# Altium schematic sheet main_board.SchDoc
size A3
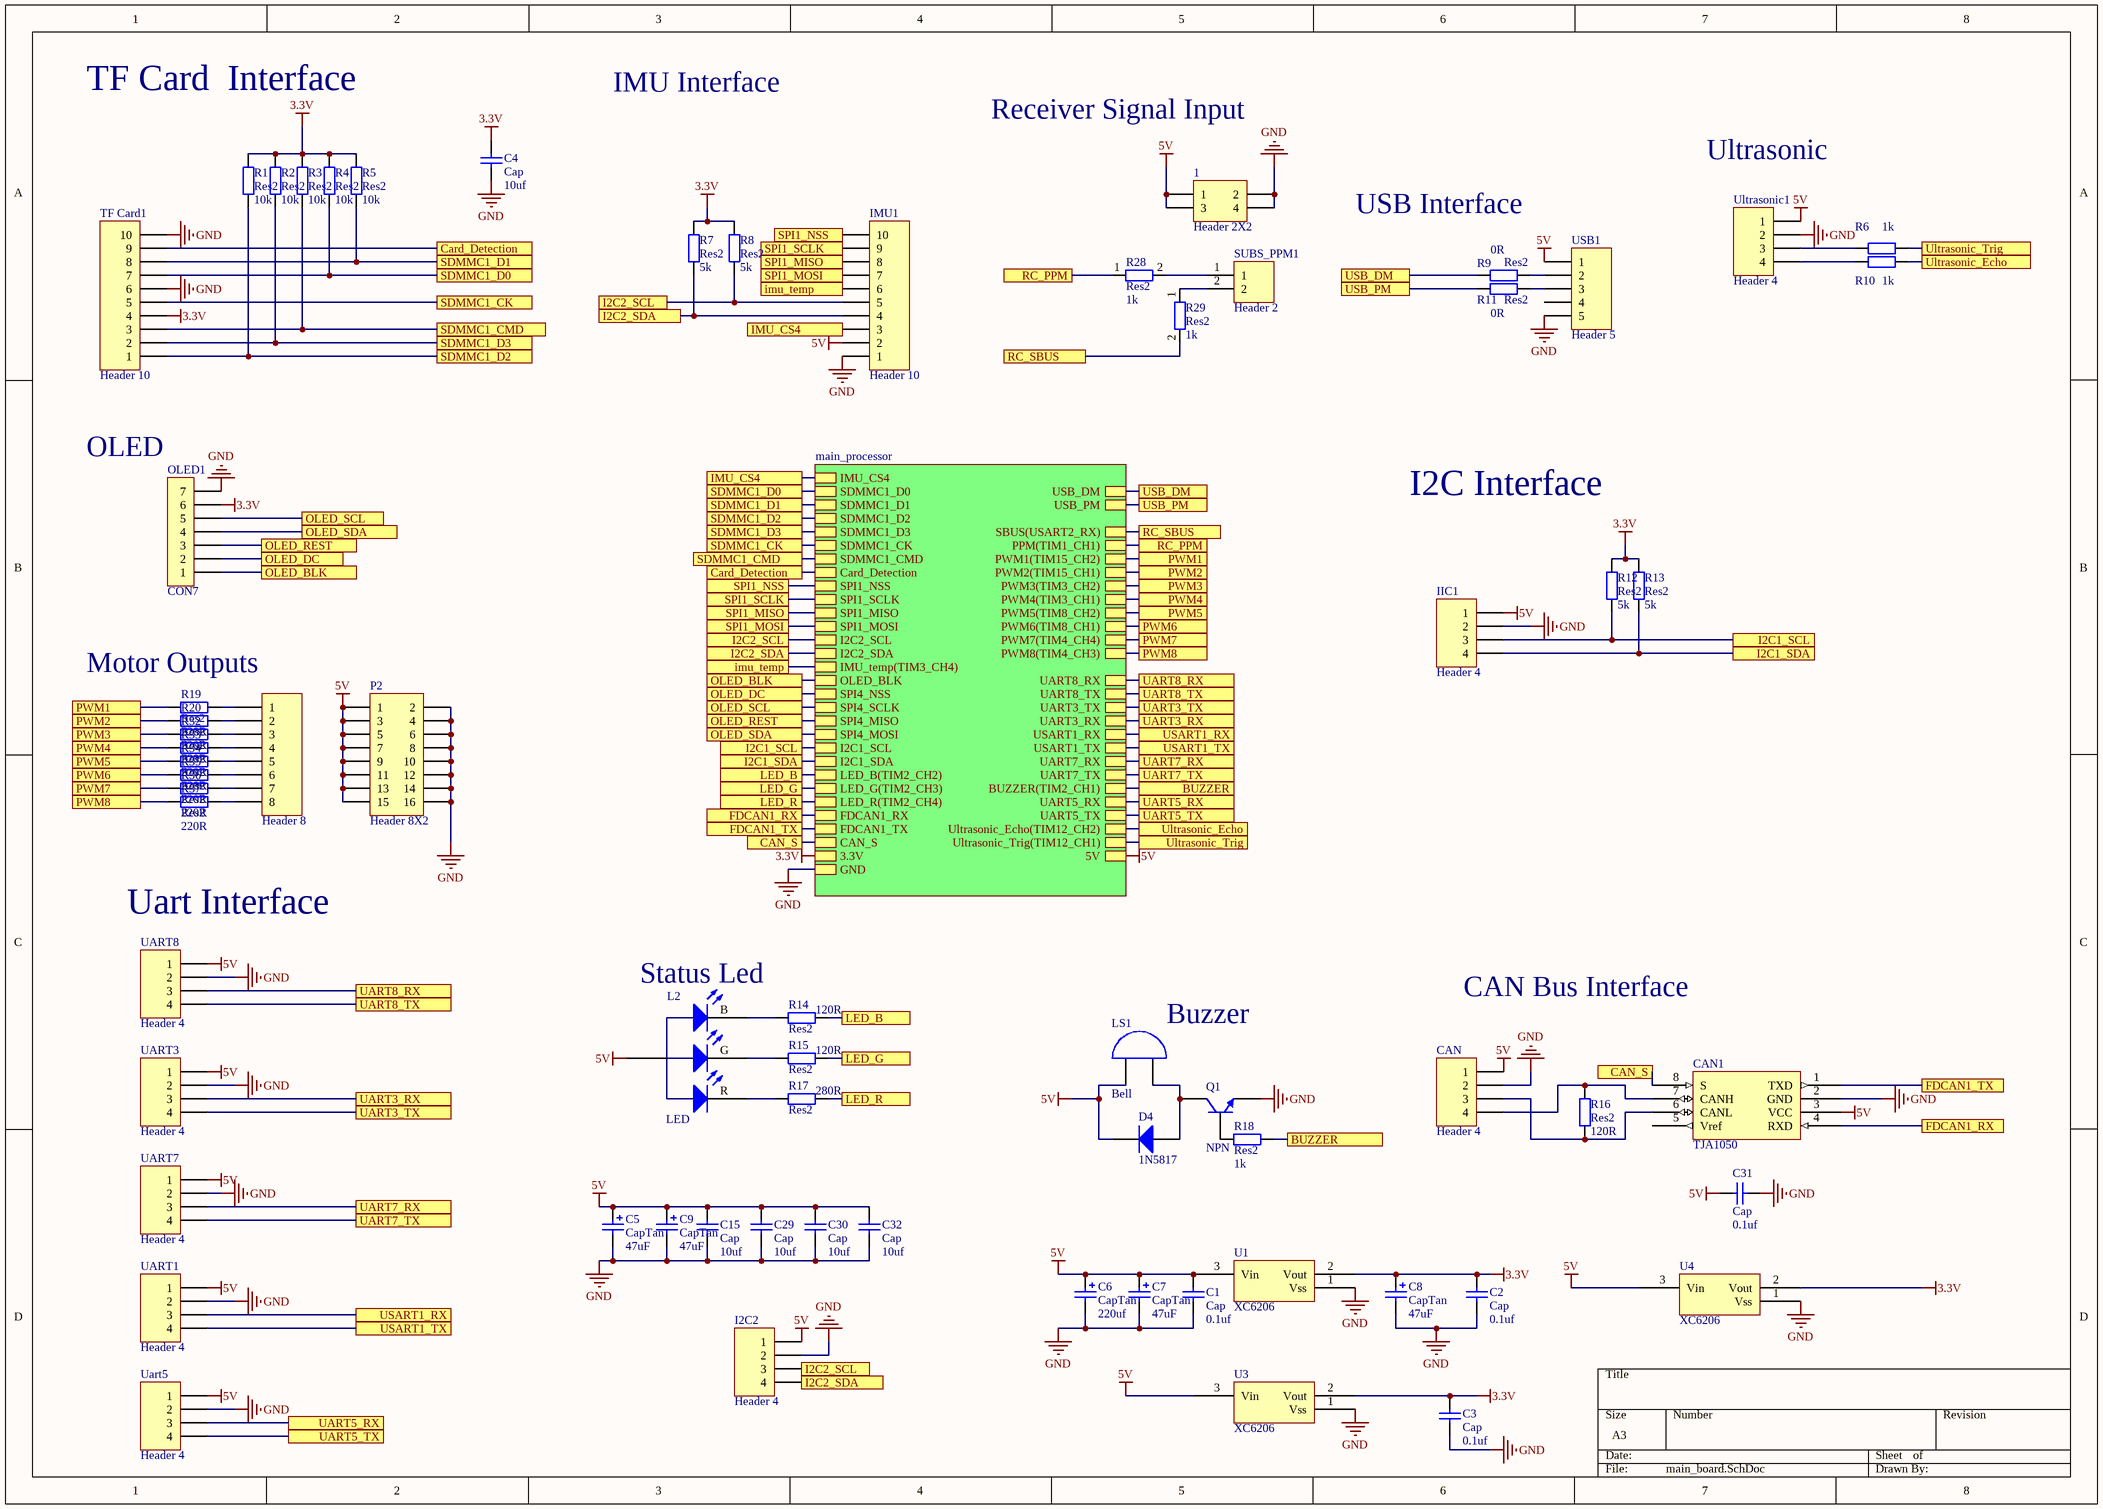
[diagram p0: main_board.SchDoc]

## Parts
1  Header 2X2  [HDR2X2]
?  Header 8  [HDR1X8]
C1  Cap  value 0.1uf  [0603]
C2  Cap  value 0.1uf  [0603]
C3  Cap  value 0.1uf  [0603]
C4  Cap  value 10uf  [0603]
C5  CapTan  value 47uF  [1206_P]
C6  CapTan  value 220uf  [3528_P]
C7  CapTan  value 47uF  [1206_P]
C8  CapTan  value 47uF  [1206_P]
C9  CapTan  value 47uF  [1206_P]
C15  Cap  value 10uf  [0603]
C29  Cap  value 10uf  [0603]
C30  Cap  value 10uf  [0603]
C31  Cap  value 0.1uf  [0603]
C32  Cap  value 10uf  [0603]
CAN  Header 4  [SH_1.25mm_LT_4P]
CAN1  TJA1050  [SO8_M]
D4  1N5817  [SOD323]
I2C2  Header 4  [SH_1.25mm_LT_4P]
IIC1  Header 4  [SH_1.25mm_LT_4P]
IMU1  Header 10  [FPC 0.5mm 10pin]
L2  LED  [LED_3528_RGB]
LS1  Bell  [Buzzer_1030]
OLED1  CON7  [HDR1X7]
P2  Header 8X2  [HDR2X8]
Q1  NPN  [SOT23_N]
R1  Res2  value 10k  [0603]
R2  Res2  value 10k  [0603]
R3  Res2  value 10k  [0603]
R4  Res2  value 10k  [0603]
R5  Res2  value 10k  [0603]
R6  value 1k  [0603]  (hidden comment: Res2)
R7  Res2  value 5k  [0603]
R8  Res2  value 5k  [0603]
R9  Res2  value 0R  [0603]
R10  value 1k  [0603]  (hidden comment: Res2)
R11  Res2  value 0R  [0603]
R12  Res2  value 5k  [0603]
R13  Res2  value 5k  [0603]
R14  Res2  value 120R  [0603]
R15  Res2  value 120R  [0603]
R16  Res2  value 120R  [0603]
R17  Res2  value 280R  [0603]
R18  Res2  value 1k  [0603]
R19  Res2  value 220R  [0603]
R20  Res2  value 220R  [0603]
R28  Res2  value 1k  [0603]
R29  Res2  value 1k  [0603]
R32  Res2  value 220R  [0603]
R33  Res2  value 220R  [0603]
R34  Res2  value 220R  [0603]
R35  Res2  value 220R  [0603]
R36  Res2  value 220R  [0603]
R37  Res2  value 220R  [0603]
SUBS_PPM1  Header 2  [HDR1X2]
TF_Card1  Header 10  [MicroSD]
U1  XC6206  [SOT23]
U3  XC6206  [SOT23]
U4  XC6206  [SOT23]
UART1  Header 4  [SH_1.25mm_LT_4P]
UART3  Header 4  [SH_1.25mm_LT_4P]
Uart5  Header 4  [SH_1.25mm_LT_4P]
UART7  Header 4  [SH_1.25mm_LT_4P]
UART8  Header 4  [SH_1.25mm_LT_4P]
Ultrasonic1  Header 4  [SH_1.25mm_LT_4P]
USB1  Header 5  [micro usb Type B SMC]

## Sub-sheets
main_processor = main_processor: SDMMC1_D0, SDMMC1_D1, SDMMC1_D2, SDMMC1_D3, SDMMC1_CK, SDMMC1_CMD, Card_Detection, SPI1_SCLK, SPI1_MISO, SPI1_MOSI, I2C2_SCL, I2C2_SDA, IMU_temp(TIM3_CH4), SPI1_NSS, SPI4_NSS, SPI4_SCLK, SPI4_MISO, SPI4_MOSI, USB_DM, USB_PM, PWM1(TIM15_CH2), PWM2(TIM15_CH1), PWM3(TIM3_CH2), PWM4(TIM3_CH1), PWM5(TIM8_CH2), PWM6(TIM8_CH1), PWM7(TIM4_CH4), PWM8(TIM4_CH3), UART8_RX, UART8_TX, UART3_TX, UART3_RX, USART1_RX, USART1_TX, UART7_RX, UART7_TX, I2C1_SCL, I2C1_SDA, LED_B(TIM2_CH2), LED_G(TIM2_CH3), LED_R(TIM2_CH4), BUZZER(TIM2_CH1), UART5_RX, UART5_TX, FDCAN1_RX, FDCAN1_TX, Ultrasonic_Echo(TIM12_CH2), Ultrasonic_Trig(TIM12_CH1), 3.3V, GND, 5V, SBUS(USART2_RX), PPM(TIM1_CH1), CAN_S, OLED_BLK, IMU_CS4

## Ports
BUZZER, CAN_S, Card_Detection, FDCAN1_RX, FDCAN1_TX, I2C1_SCL, I2C1_SDA, I2C2_SCL, I2C2_SDA, IMU_CS4, imu_temp, LED_B, LED_G, LED_R, OLED_BLK, OLED_DC, OLED_REST, OLED_SCL, OLED_SDA, PWM1, PWM2, PWM3, PWM4, PWM5, PWM6, PWM7, PWM8, RC_PPM, RC_SBUS, SDMMC1_CK, SDMMC1_CMD, SDMMC1_D0, SDMMC1_D1, SDMMC1_D2, SDMMC1_D3, SPI1_MISO, SPI1_MOSI, SPI1_NSS, SPI1_SCLK, UART3_RX, UART3_TX, UART5_RX, UART5_TX, UART7_RX, UART7_TX, UART8_RX, UART8_TX, Ultrasonic_Echo, Ultrasonic_Trig, USART1_RX, USART1_TX, USB_DM, USB_PM

## Nets
3.3V: C2.2 C3.2 C4.2 C8.1 OLED1.6 R1.2 R2.2 R3.1 R4.2 R5.2 R7.2 R8.2 R12.2 R13.2 TF_Card1.4 U1.2(Vout) U3.2(Vout) U4.2(Vout) ; sheet main_processor/3.3V
5V: 1.1 1.3 C1.2 C5.1 C6.1 C7.1 C9.1 C15.2 C29.2 C30.2 C31.2 C32.2 CAN.1 CAN1.3(VCC) D4.2(K) I2C2.1 IIC1.1 IMU1.2 L2.1 LS1.1(A) P2.1 P2.3 P2.5 P2.7 P2.9 P2.11 P2.13 P2.15 U1.3(Vin) U3.3(Vin) U4.3(Vin) UART1.1 UART3.1 Uart5.1 UART7.1 UART8.1 Ultrasonic1.1 USB1.1 ; sheet main_processor/5V
GND: 1.2 1.4 C1.1 C2.1 C3.1 C4.1 C5.2 C6.2 C7.2 C8.2 C9.2 C15.1 C29.1 C30.1 C31.1 C32.1 CAN.2 CAN1.2(GND) I2C2.2 IIC1.2 IMU1.1 OLED1.7 P2.2 P2.4 P2.6 P2.8 P2.10 P2.12 P2.14 P2.16 Q1.3(E) TF_Card1.6 TF_Card1.10 U1.1(Vss) U3.1(Vss) U4.1(Vss) UART1.2 UART3.2 Uart5.2 UART7.2 UART8.2 Ultrasonic1.2 USB1.5 ; sheet main_processor/GND
BUZZER: R18.1 ; port BUZZER, sheet main_processor/BUZZER(TIM2_CH1)
CAN_S: CAN1.8(S) ; port CAN_S, sheet main_processor/CAN_S
Card_Detection: TF_Card1.9 ; port Card_Detection, sheet main_processor/Card_Detection
FDCAN1_RX: CAN1.4(RXD) ; port FDCAN1_RX, sheet main_processor/FDCAN1_RX
FDCAN1_TX: CAN1.1(TXD) ; port FDCAN1_TX, sheet main_processor/FDCAN1_TX
I2C1_SCL: IIC1.3 R12.1 ; port I2C1_SCL, sheet main_processor/I2C1_SCL
I2C1_SDA: IIC1.4 R13.1 ; port I2C1_SDA, sheet main_processor/I2C1_SDA
I2C2_SCL: I2C2.3 IMU1.5 R8.1 ; port I2C2_SCL, sheet main_processor/I2C2_SCL
I2C2_SDA: I2C2.4 IMU1.4 R7.1 ; port I2C2_SDA, sheet main_processor/I2C2_SDA
IMU_CS4: IMU1.3 ; port IMU_CS4, sheet main_processor/IMU_CS4
imu_temp: IMU1.6 ; port imu_temp, sheet main_processor/IMU_temp(TIM3_CH4)
LED_B: R14.1 ; port LED_B, sheet main_processor/LED_B(TIM2_CH2)
LED_G: R15.1 ; port LED_G, sheet main_processor/LED_G(TIM2_CH3)
LED_R: R17.1 ; port LED_R, sheet main_processor/LED_R(TIM2_CH4)
OLED_BLK: OLED1.1 ; port OLED_BLK, sheet main_processor/OLED_BLK
OLED_DC: OLED1.2 ; port OLED_DC, sheet main_processor/SPI4_NSS
OLED_REST: OLED1.3 ; port OLED_REST, sheet main_processor/SPI4_MISO
OLED_SCL: OLED1.5 ; port OLED_SCL, sheet main_processor/SPI4_SCLK
OLED_SDA: OLED1.4 ; port OLED_SDA, sheet main_processor/SPI4_MOSI
PWM1: R19.2 ; port PWM1, sheet main_processor/PWM1(TIM15_CH2)
PWM2: R20.2 ; port PWM2, sheet main_processor/PWM2(TIM15_CH1)
PWM3: R32.2 ; port PWM3, sheet main_processor/PWM3(TIM3_CH2)
PWM4: R33.2 ; port PWM4, sheet main_processor/PWM4(TIM3_CH1)
PWM5: R34.2 ; port PWM5, sheet main_processor/PWM5(TIM8_CH2)
PWM6: R35.2 ; port PWM6, sheet main_processor/PWM6(TIM8_CH1)
PWM7: R36.2 ; port PWM7, sheet main_processor/PWM7(TIM4_CH4)
PWM8: R37.2 ; port PWM8, sheet main_processor/PWM8(TIM4_CH3)
RC_PPM: R28.1 ; port RC_PPM, sheet main_processor/PPM(TIM1_CH1)
RC_SBUS: R29.2 ; port RC_SBUS, sheet main_processor/SBUS(USART2_RX)
SDMMC1_CK: TF_Card1.5 ; port SDMMC1_CK, sheet main_processor/SDMMC1_CK
SDMMC1_CMD: R3.2 TF_Card1.3 ; port SDMMC1_CMD, sheet main_processor/SDMMC1_CMD
SDMMC1_D0: R4.1 TF_Card1.7 ; port SDMMC1_D0, sheet main_processor/SDMMC1_D0
SDMMC1_D1: R5.1 TF_Card1.8 ; port SDMMC1_D1, sheet main_processor/SDMMC1_D1
SDMMC1_D2: R1.1 TF_Card1.1 ; port SDMMC1_D2, sheet main_processor/SDMMC1_D2
SDMMC1_D3: R2.1 TF_Card1.2 ; port SDMMC1_D3, sheet main_processor/SDMMC1_D3
SPI1_MISO: IMU1.8 ; port SPI1_MISO, sheet main_processor/SPI1_MISO
SPI1_MOSI: IMU1.7 ; port SPI1_MOSI, sheet main_processor/SPI1_MOSI
SPI1_NSS: IMU1.10 ; port SPI1_NSS, sheet main_processor/SPI1_NSS
SPI1_SCLK: IMU1.9 ; port SPI1_SCLK, sheet main_processor/SPI1_SCLK
UART3_RX: UART3.3 ; port UART3_RX, sheet main_processor/UART3_RX
UART3_TX: UART3.4 ; port UART3_TX, sheet main_processor/UART3_TX
UART5_RX: Uart5.3 ; port UART5_RX, sheet main_processor/UART5_RX
UART5_TX: Uart5.4 ; port UART5_TX, sheet main_processor/UART5_TX
UART7_RX: UART7.3 ; port UART7_RX, sheet main_processor/UART7_RX
UART7_TX: UART7.4 ; port UART7_TX, sheet main_processor/UART7_TX
UART8_RX: UART8.3 ; port UART8_RX, sheet main_processor/UART8_RX
UART8_TX: UART8.4 ; port UART8_TX, sheet main_processor/UART8_TX
Ultrasonic_Echo: R10.1 ; port Ultrasonic_Echo, sheet main_processor/Ultrasonic_Echo(TIM12_CH2)
Ultrasonic_Trig: R6.1 ; port Ultrasonic_Trig, sheet main_processor/Ultrasonic_Trig(TIM12_CH1)
USART1_RX: UART1.3 ; port USART1_RX, sheet main_processor/USART1_RX
USART1_TX: UART1.4 ; port USART1_TX, sheet main_processor/USART1_TX
USB_DM: R9.2 ; port USB_DM, sheet main_processor/USB_DM
USB_PM: R11.2 ; port USB_PM, sheet main_processor/USB_PM
Net?_1: ?.1 R19.1
Net?_2: ?.2 R20.1
Net?_3: ?.3 R32.1
Net?_4: ?.4 R33.1
Net?_5: ?.5 R34.1
Net?_6: ?.6 R35.1
Net?_7: ?.7 R36.1
Net?_8: ?.8 R37.1
NetCAN_3: CAN.3 CAN1.6(CANL) R16.1
NetCAN_4: CAN.4 CAN1.7(CANH) R16.2
NetD4_1: D4.1(A) LS1.2(B) Q1.1(C)
NetL2_B: L2.B R14.2
NetL2_G: L2.G R15.2
NetL2_R: L2.R R17.2
NetQ1_2: Q1.2(B) R18.2
NetR6_2: R6.2 Ultrasonic1.3
NetR9_1: R9.1 USB1.2
NetR10_2: R10.2 Ultrasonic1.4
NetR11_1: R11.1 USB1.3
NetR28_2: R28.2 SUBS_PPM1.1
NetR29_1: R29.1 SUBS_PPM1.2

Not connected (* = marked no-connect by the designer): CAN1 5(Vref); USB1 4

## Notes on the sheet
- TF Card  Interface
- IMU Interface
- Receiver Signal Input
- Ultrasonic
- USB Interface
- OLED
- I2C Interface
- Motor Outputs
- (near UART8) Uart Interface
- Status Led
- (near LS1) Buzzer
- CAN Bus Interface

## Library data of the parts
1 = Header 2X2: Header, 2-Pin, Dual row; LatestRevisionDate: 17-Jul-2002; LatestRevisionNote: Re-released for DXP Platform.; Publisher: Altium Limited
? = Header 8: Header, 8-Pin; LatestRevisionDate: 17-Jul-2002; LatestRevisionNote: Re-released for DXP Platform.; Publisher: Altium Limited
C1-C4 C15 C29-C32 = Cap: Capacitor; Published: 8-Jun-2000; LatestRevisionDate: 17-Jul-2002; LatestRevisionNote: Re-released for DXP Platform.; PackageReference: RAD-0.3; Publisher: Altium Limited; PackageDescription: Radial Cap, Thru-Hole; 2 Leads; 0.3 in Pin Spacing
C5-C9 = Cap Pol2: Polarized Capacitor (Axial); Published: 8-Jun-2000; LatestRevisionDate: 17-Jul-2002; LatestRevisionNote: Re-released for DXP Platform.; PackageReference: POLAR0.8; Publisher: Altium Limited; PackageDescription: Polarized Capacitor; 2 Leads
CAN I2C2 IIC1 UART1 UART3 Uart5 UART7 UART8 Ultrasonic1 = Header 4: Header, 4-Pin; LatestRevisionDate: 17-Jul-2002; LatestRevisionNote: Re-released for DXP Platform.; Publisher: Altium Limited
CAN1 = TJA1050: High speed CAN transceiver
D4 = Diode: Default Diode; Published: 8-Jun-2000; LatestRevisionDate: 17-Jul-2002; LatestRevisionNote: Re-released for DXP Platform.; PackageVersion: Sep-1996; PackageReference: SMC; Publisher: Altium Limited; PackageDescription: DO-214-AB/SMC; 2 C-Bend Leads; Body 7.9 x 5.9 mm, inc. leads (LxW); Code_JEDEC: DO-214-AB
IMU1 TF_Card1 = Header 10: Header, 10-Pin; LatestRevisionDate: 17-Jul-2002; LatestRevisionNote: Re-released for DXP Platform.; Publisher: Altium Limited
L2 = LED_RGB_CommonAnode: pin to pad: B>2 G>3 R>4
LS1 = Bell: Electrical Bell; Published: 24-Mar-1999; LatestRevisionDate: 17-Jul-2002; LatestRevisionNote: Re-released for DXP Platform.; PackageReference: PIN2; Publisher: Altium Limited
OLED1 = CON7: Connector
P2 = Header 8X2: Header, 8-Pin, Dual row; LatestRevisionDate: 17-Jul-2002; LatestRevisionNote: Re-released for DXP Platform.; Publisher: Altium Limited
Q1 = NPN: NPN Bipolar Transistor; pin to pad: 2>3 3>2; Published: 8-Jun-2000; LatestRevisionDate: 17-Jul-2002; LatestRevisionNote: Re-released for DXP Platform.; PackageReference: TO-226-AA; Publisher: Altium Limited; PackageDescription: TO, Flat Index; 3 In-Line, Axial Leads; Body Dia. 4.8mm; Leads 0.55 x 0.51 mm (max); Code_JEDEC: TO-226-AA
R1-R20 R28 R29 R32-R37 = Res2: Resistor; Published: 8-Jun-2000; LatestRevisionDate: 17-Jul-2002; LatestRevisionNote: Re-released for DXP Platform.; PackageReference: AXIAL-0.4; Publisher: Altium Limited; PackageDescription: Axial Device, Thru-Hole; 2 Leads; 0.4 in Pin Spacing
SUBS_PPM1 = Header 2: Header, 2-Pin; LatestRevisionDate: 17-Jul-2002; LatestRevisionNote: Re-released for DXP Platform.; Publisher: Altium Limited
USB1 = Header 5: Header, 5-Pin; LatestRevisionDate: 17-Jul-2002; LatestRevisionNote: Re-released for DXP Platform.; Publisher: Altium Limited